# Altium project Acquisition-System.PrjPcb
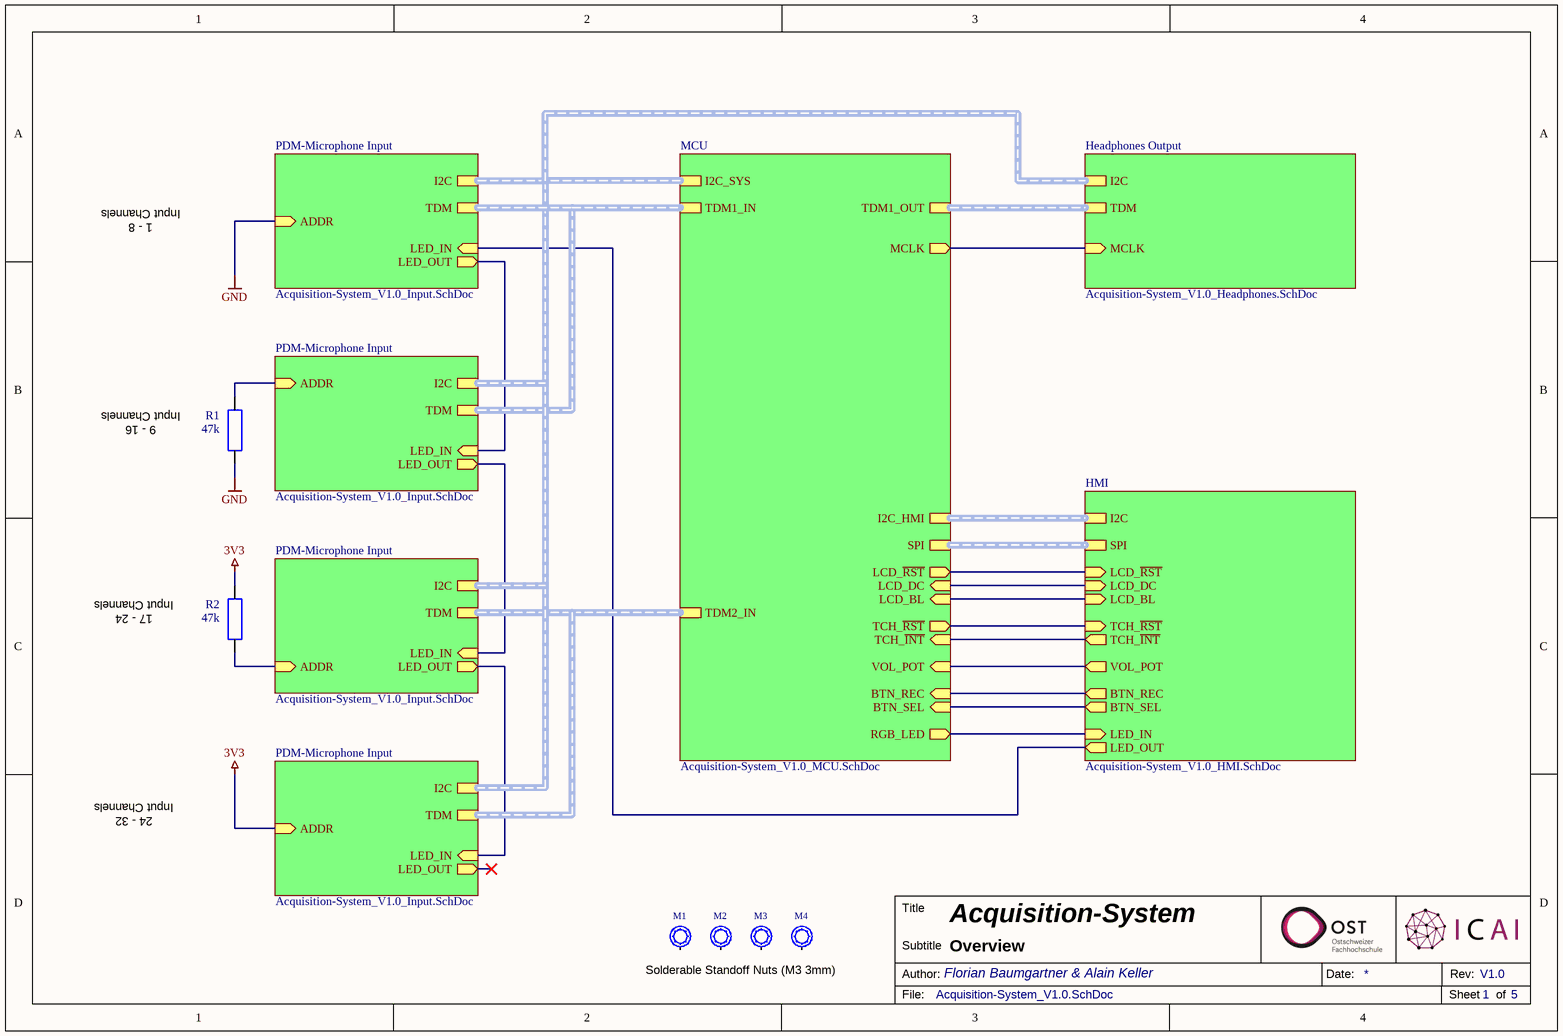
[diagram p0: Acquisition-System_V1.0.SchDoc]
5 sheets, 241 parts. Net scope: hierarchical (ports join the sheet entries above them; power ports are global).
Board file: Acquisition-System_V1.0.PcbDoc
Sheets:
  Acquisition-System_V1.0.SchDoc
    PDM-Microphone Input = Acquisition-System_V1.0_Input.SchDoc
    PDM-Microphone Input = Acquisition-System_V1.0_Input.SchDoc
    PDM-Microphone Input = Acquisition-System_V1.0_Input.SchDoc
    PDM-Microphone Input = Acquisition-System_V1.0_Input.SchDoc
    Headphones Output = Acquisition-System_V1.0_Headphones.SchDoc
    HMI = Acquisition-System_V1.0_HMI.SchDoc
    MCU = Acquisition-System_V1.0_MCU.SchDoc

## Sheet Acquisition-System_V1.0.SchDoc: Acquisition-System
size A4; PageSetup: Record=PageOptions|CenterHorizontal=True|CenterVertical=True|PrintScale=0.97|XCorrection=1.00|YCorrection=1.00|PrintKind=0|BorderSize=5000000|LeftOffset=0|BottomOffset=0|Orientation=2|PaperLength=1000|PaperWidth=1000|Scale=100|PaperSource=7|PrintQuality=-3|MediaType=1|DitherType=10|PrintScaleMode=1|PaperKind=A4|PaperIndex=9; Organization: Ostschweizer Fachhochschule; Address2: Florian Baumgartner & Alain Keller; Address3: florian.baumgartner@ost.ch; DocumentNumber: 1; Revision: V1.0; SheetNumber: 1; SheetTotal: 5; Author: Florian Baumgartner & Alain Keller; Subtitle: Overview

### Parts
M1  SMTSO-M3-3ET  [SMD Solder-Nut (M3 3mm)]  (value not drawn)
M2  SMTSO-M3-3ET  [SMD Solder-Nut (M3 3mm)]  (value not drawn)
M3  SMTSO-M3-3ET  [SMD Solder-Nut (M3 3mm)]  (value not drawn)
M4  SMTSO-M3-3ET  [SMD Solder-Nut (M3 3mm)]  (value not drawn)
R1  47k  [SMD Keramikkondensator 0603]
R2  47k  [SMD Keramikkondensator 0603]

### Sub-sheets
Headphones Output = Acquisition-System_V1.0_Headphones.SchDoc: I2C (harness I2C), TDM (harness TDM), MCLK (in)
HMI = Acquisition-System_V1.0_HMI.SchDoc: TCH_~{INT} (out), BTN_REC (out), TCH_~{RST} (in), LCD_BL (in), LCD_~{RST} (in), LED_IN (in), BTN_SEL (out), I2C (harness I2C), LCD_DC (in), SPI (harness SPI), VOL_POT (out), LED_OUT (out)
MCU = Acquisition-System_V1.0_MCU.SchDoc: I2C_SYS (harness I2C_SYS), LCD_BL (in), VOL_POT (in), MCLK (out), LCD_DC (in), TCH_~{RST} (out), RGB_LED (out), I2C_HMI (harness I2C_HMI), LCD_~{RST} (out), TDM1_OUT (harness TDM1_OUT), SPI (harness SPI), BTN_REC (in), BTN_SEL (in), TCH_~{INT} (in), TDM1_IN (harness TDM1_IN), TDM2_IN (harness TDM2_IN)
PDM-Microphone Input = Acquisition-System_V1.0_Input.SchDoc: I2C (harness I2C), LED_IN (in), TDM (harness TDM), LED_OUT (out), ADDR (in)
PDM-Microphone Input = Acquisition-System_V1.0_Input.SchDoc: I2C (harness I2C), LED_IN (in), TDM (harness TDM), LED_OUT (out), ADDR (in)
PDM-Microphone Input = Acquisition-System_V1.0_Input.SchDoc: I2C (harness I2C), LED_IN (in), TDM (harness TDM), LED_OUT (out), ADDR (in)
PDM-Microphone Input = Acquisition-System_V1.0_Input.SchDoc: I2C (harness I2C), LED_IN (in), TDM (harness TDM), LED_OUT (out), ADDR (in)

### Nets
3V3: R2.2 ; sheet PDM-Microphone Input/ADDR
GND: R1.1 ; sheet PDM-Microphone Input/ADDR
BTN_REC: sheet HMI/BTN_REC, sheet MCU/BTN_REC
BTN_SEL: sheet HMI/BTN_SEL, sheet MCU/BTN_SEL
LCD_BL: sheet HMI/LCD_BL, sheet MCU/LCD_BL
LCD_DC: sheet HMI/LCD_DC, sheet MCU/LCD_DC
LCD_~{RST}: sheet HMI/LCD_~{RST}, sheet MCU/LCD_~{RST}
RGB_LED: sheet HMI/LED_IN, sheet MCU/RGB_LED
TCH_~{INT}: sheet HMI/TCH_~{INT}, sheet MCU/TCH_~{INT}
TCH_~{RST}: sheet HMI/TCH_~{RST}, sheet MCU/TCH_~{RST}
TDM1_MCLK: sheet Headphones Output/MCLK, sheet MCU/MCLK
VOL_POT: sheet HMI/VOL_POT, sheet MCU/VOL_POT
NetP1A_4: sheet PDM-Microphone Input/LED_IN, sheet PDM-Microphone Input/LED_OUT
NetP1B_4: sheet PDM-Microphone Input/LED_IN, sheet PDM-Microphone Input/LED_OUT
NetP1C_4: sheet PDM-Microphone Input/LED_IN, sheet PDM-Microphone Input/LED_OUT
NetP1D_4: sheet PDM-Microphone Input/LED_IN, sheet HMI/LED_OUT
NetR1_2: R1.2 ; sheet PDM-Microphone Input/ADDR
NetR2_1: R2.1 ; sheet PDM-Microphone Input/ADDR

Not connected (* = marked no-connect by the designer): M1 1; M2 1; M3 1; M4 1

### Buses and harness runs
harness sheet Headphones Output/I2C = sheet MCU/I2C_SYS = sheet PDM-Microphone Input/I2C
harness sheet Headphones Output/TDM = sheet MCU/TDM1_OUT
harness sheet HMI/I2C = sheet MCU/I2C_HMI
harness sheet HMI/SPI = sheet MCU/SPI
harness sheet MCU/TDM1_IN = sheet PDM-Microphone Input/TDM
harness sheet MCU/TDM2_IN = sheet PDM-Microphone Input/TDM

### Notes on the sheet
- Input Channels
- 1 - 8
- (near R1) Input Channels
- 9 - 16
- 17 - 24
- 24 - 32
- Solderable Standoff Nuts (M3 3mm)
- Title
- Author:
- Subtitle
- Date:
- Rev:
- File:
- Sheet
- of

### Library data of the parts
M1-M4 = M-Spacer_M3_3mm: Solderable Standoff Nut; Component Value: M3 3mm; Mouser: 153-SMTSO-M3-3ET; Component Description: Solderable Standoff Nut; Unit Price: 0.05; JLC-Parts: C2915308; ComponentLink1Description: Datasheet; ComponentLink1URL: https://datasheet.lcsc.com/lcsc/2112061830_Sinhoo-SMTSO3030CTJ_C2915308.pdf
R1 R2 = R-RESISTOR: RES (E=Heizwiderstand B=Messwandler); Component Description: Thick Film Chip Resistor; Component Value: 47k (75V, 100mW, 1%); Digikey: P47.0KHCT-ND; Farnell: 2303213; Mouser: 667-ERJ-3EKF4702V; JLC-Parts: C25819; Unit Price: 0.01

## Sheet Acquisition-System_V1.0_Input.SchDoc: Acquisition-System
size A4; PageSetup: Record=PageOptions|CenterHorizontal=True|CenterVertical=True|PrintScale=0.97|XCorrection=1.00|YCorrection=1.00|PrintKind=0|BorderSize=5000000|LeftOffset=0|BottomOffset=0|Orientation=2|PaperLength=1000|PaperWidth=1000|Scale=100|PaperSource=7|PrintQuality=-3|MediaType=1|DitherType=10|PrintScaleMode=1|PaperKind=A4|PaperIndex=9; Organization: Ostschweizer Fachhochschule; Address2: Florian Baumgartner & Thierry Schwaller; Address3: florian.baumgartner@ost.ch; DocumentNumber: 2; Revision: V1.0; SheetNumber: 2; SheetTotal: 5; Author: Florian Baumgartner & Alain Keller; Subtitle: PDM-Microphone Input
Used 4 times, as channels PDM-Microphone Input, PDM-Microphone Input, PDM-Microphone Input, PDM-Microphone Input. Parts and nets are listed once, with the designators drawn on the sheet.
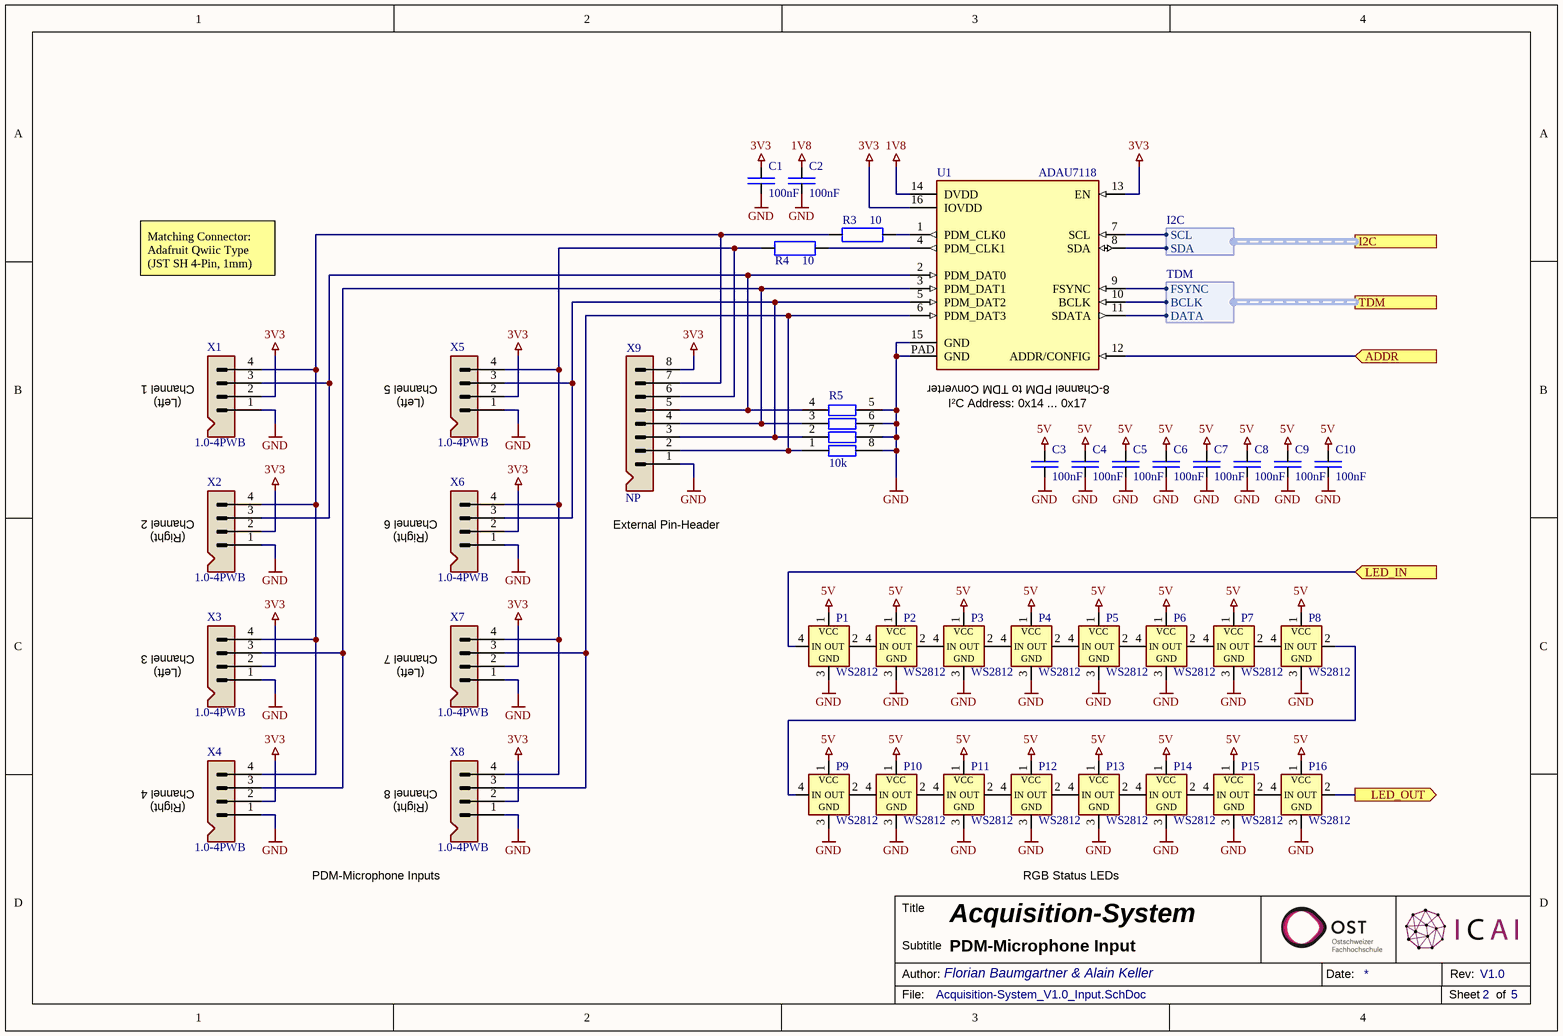
[diagram p1: Acquisition-System_V1.0_Input.SchDoc]

### Parts
C1  100nF  [SMD Keramikkondensator 0603]
C2  100nF  [SMD Keramikkondensator 0603]
C3  100nF  [SMD Keramikkondensator 0603]
C4  100nF  [SMD Keramikkondensator 0603]
C5  100nF  [SMD Keramikkondensator 0603]
C6  100nF  [SMD Keramikkondensator 0603]
C7  100nF  [SMD Keramikkondensator 0603]
C8  100nF  [SMD Keramikkondensator 0603]
C9  100nF  [SMD Keramikkondensator 0603]
C10  100nF  [SMD Keramikkondensator 0603]
P1  WS2812  [SMD LED WS2812B-0807]
P2  WS2812  [SMD LED WS2812B-0807]
P3  WS2812  [SMD LED WS2812B-0807]
P4  WS2812  [SMD LED WS2812B-0807]
P5  WS2812  [SMD LED WS2812B-0807]
P6  WS2812  [SMD LED WS2812B-0807]
P7  WS2812  [SMD LED WS2812B-0807]
P8  WS2812  [SMD LED WS2812B-0807]
P9  WS2812  [SMD LED WS2812B-0807]
P10  WS2812  [SMD LED WS2812B-0807]
P11  WS2812  [SMD LED WS2812B-0807]
P12  WS2812  [SMD LED WS2812B-0807]
P13  WS2812  [SMD LED WS2812B-0807]
P14  WS2812  [SMD LED WS2812B-0807]
P15  WS2812  [SMD LED WS2812B-0807]
P16  WS2812  [SMD LED WS2812B-0807]
R3  10  [SMD Widerstand 0603]
R4  10  [SMD Widerstand 0603]
R5  10k  [SMD Widerstand Array 4-Fach 0603]
U1  ADAU7118  [SMD IC QFN-16]
X1  1.0-4PWB  [SMD Connector (SM04B-SRSS-TB)]
X2  1.0-4PWB  [SMD Connector (SM04B-SRSS-TB)]
X3  1.0-4PWB  [SMD Connector (SM04B-SRSS-TB)]
X4  1.0-4PWB  [SMD Connector (SM04B-SRSS-TB)]
X5  1.0-4PWB  [SMD Connector (SM04B-SRSS-TB)]
X6  1.0-4PWB  [SMD Connector (SM04B-SRSS-TB)]
X7  1.0-4PWB  [SMD Connector (SM04B-SRSS-TB)]
X8  1.0-4PWB  [SMD Connector (SM04B-SRSS-TB)]
X9  NP  [THT Pin-Header 1x8 (NP)]

### Ports
ADDR (in), I2C (harness I2C), LED_IN (in), LED_OUT (out), TDM (harness TDM)

### Harnesses
TDM: BCLK, FSYNC, DATA
I2C: SCL, SDA

### Nets
1V8: C2.2 U1.14(DVDD)
3V3: C1.2 U1.13(EN) U1.16(IOVDD) X1.2 X2.2 X3.2 X4.2 X5.2 X6.2 X7.2 X8.2 X9.8
5V: C3.2 C4.2 C5.2 C6.2 C7.2 C8.2 C9.2 C10.2 P1.1(VCC) P2.1(VCC) P3.1(VCC) P4.1(VCC) P5.1(VCC) P6.1(VCC) P7.1(VCC) P8.1(VCC) P9.1(VCC) P10.1(VCC) P11.1(VCC) P12.1(VCC) P13.1(VCC) P14.1(VCC) P15.1(VCC) P16.1(VCC)
GND: C1.1 C2.1 C3.1 C4.1 C5.1 C6.1 C7.1 C8.1 C9.1 C10.1 P1.3(GND) P2.3(GND) P3.3(GND) P4.3(GND) P5.3(GND) P6.3(GND) P7.3(GND) P8.3(GND) P9.3(GND) P10.3(GND) P11.3(GND) P12.3(GND) P13.3(GND) P14.3(GND) P15.3(GND) P16.3(GND) R5.5 R5.6 R5.7 R5.8 U1.15(GND) U1.PAD(GND) X1.1 X2.1 X3.1 X4.1 X5.1 X6.1 X7.1 X8.1 X9.1
ADDR: U1.12(ADDR/CONFIG) ; port ADDR
LED_IN: P1.4(IN) ; port LED_IN
LED_OUT: P16.2(OUT) ; port LED_OUT
NetP1_2: P1.2(OUT) P2.4(IN)
NetP2_2: P2.2(OUT) P3.4(IN)
NetP3_2: P3.2(OUT) P4.4(IN)
NetP4_2: P4.2(OUT) P5.4(IN)
NetP5_2: P5.2(OUT) P6.4(IN)
NetP6_2: P6.2(OUT) P7.4(IN)
NetP7_2: P7.2(OUT) P8.4(IN)
NetP8_2: P8.2(OUT) P9.4(IN)
NetP9_2: P9.2(OUT) P10.4(IN)
NetP10_2: P10.2(OUT) P11.4(IN)
NetP11_2: P11.2(OUT) P12.4(IN)
NetP12_2: P12.2(OUT) P13.4(IN)
NetP13_2: P13.2(OUT) P14.4(IN)
NetP14_2: P14.2(OUT) P15.4(IN)
NetP15_2: P15.2(OUT) P16.4(IN)
NetR3_1: R3.1 U1.1(PDM_CLK0)
NetR3_2: R3.2 X1.4 X2.4 X3.4 X4.4 X9.7
NetR4_1: R4.1 U1.4(PDM_CLK1)
NetR4_2: R4.2 X5.4 X6.4 X7.4 X8.4 X9.6
NetR5_1: R5.1 U1.6(PDM_DAT3) X7.3 X8.3 X9.2
NetR5_2: R5.2 U1.5(PDM_DAT2) X5.3 X6.3 X9.3
NetR5_3: R5.3 U1.3(PDM_DAT1) X3.3 X4.3 X9.4
NetR5_4: R5.4 U1.2(PDM_DAT0) X1.3 X2.3 X9.5
NetU1_7: U1.7(SCL) ; port I2C.SCL
NetU1_8: U1.8(SDA) ; port I2C.SDA
NetU1_9: U1.9(NC) ; port TDM.FSYNC
NetU1_10: U1.10(NC) ; port TDM.BCLK
NetU1_11: U1.11(NC) ; port TDM.DATA

### Channels
PDM-Microphone Input: designators end in A; ports ADDR=3V3 LED_IN=NetP1A_4 LED_OUT=NetP16A_2
PDM-Microphone Input: designators end in B; ports ADDR=NetR2_1 LED_IN=NetP1B_4 LED_OUT=NetP1A_4
PDM-Microphone Input: designators end in C; ports ADDR=NetR1_2 LED_IN=NetP1C_4 LED_OUT=NetP1B_4
PDM-Microphone Input: designators end in D; ports ADDR=GND LED_IN=NetP1D_4 LED_OUT=NetP1C_4

### Notes on the sheet
- Matching Connector:
  Adafruit Qwiic Type
  (JST SH 4-Pin, 1mm)
- (near X1) Channel 1
- (near X5) Channel 5
- (near U1) 8-Channel PDM to TDM Converter
- (near X1) (Left)
- (near X5) (Left)
- I²C Address: 0x14 ... 0x17
- (near X2) Channel 2
- (near X6) Channel 6
- External Pin-Header
- (near X2) (Right)
- (near X6) (Right)
- (near X3) Channel 3
- (near X7) Channel 7
- (near X3) (Left)
- (near X7) (Left)
- (near X4) Channel 4
- (near X8) Channel 8
- (near X4) (Right)
- (near X8) (Right)
- PDM-Microphone Inputs
- RGB Status LEDs
- Title
- Author:
- Subtitle
- Date:
- Rev:
- File:
- Sheet
- of

### Library data of the parts
C1-C10 = E6 - 100nF: SMD Ceramic Capacitor E6; Component Value: 100nF 50V; Component Description: Multilayer Ceramic Capacitors MLCC; ComponentLink1Description: Datasheet; ComponentLink1URL: https://datasheet.lcsc.com/lcsc/1809301912_YAGEO-CC0603KRX7R9BB104_C14663.pdf; Digikey: 445-6899-1-ND; Farnell: 2210822; JLC-Parts: C14663; Mouser: 810-CGA2B3X7R1H104K; Unit Price: 0.01
P1-P16 = P-WS2812B-0807: Smart RGB-LED; aliExpress: 1005003999865721; Component Value: XL-0807RGBC-WS2812B; JLC-Parts: C3646929; ComponentLink1Description: Datasheet; ComponentLink1URL: https://datasheet.lcsc.com/lcsc/2108251530_OPSCO-Optoelectronics-SK6812D-EC3210R_C2890041.pdf; Component Description: Smart RGB-LED; Unit Price: 0.07
R3 R4 = R-RESISTOR: RES (E=Heizwiderstand B=Messwandler); Component Description: Thick Film Chip Resistor; Component Value: 10 (75V, 100mW, 1%); Digikey: P10.0HCT-ND; Farnell: 2302958; Mouser: 667-ERJ-3EKF10R0V; JLC-Parts: C22859; Unit Price: 0.01
R5 = R-Array Single Quad E24 - 10k: Isolated Resistor Array; Component Value: 10k (4x, 50V, 62.5mW, 5%); ComponentLink1Description: Datasheet; ComponentLink1URL: https://datasheet.lcsc.com/lcsc/1810191515_UNI-ROYAL-Uniroyal-Elec-4D03WGJ0103T5E_C29718.pdf; Digikey: Y4103CT-ND; Farnell: 2060167; JLC-Parts: C29718; Mouser: 667-EXB-V8V103JV; Unit Price: 0.01; Component Description: Isolated Resistor Array
U1 = U-ADAU7118: 8-Channel PDM to I²S/TDM Converter; Component Value: ADAU7118ACPZRL; ComponentLink1Description: Datasheet; ComponentLink1URL: https://www.analog.com/media/en/technical-documentation/data-sheets/ADAU7118.pdf; Digikey: 505-ADAU7118ACPZRLCT-ND; Farnell: 4033291; JLC-Parts: C654437; Mouser: 584-ADAU7118ACPZRL; Unit Price: 6.20; Component Description: 8-Channel PDM to I²S/TDM Converter
X1-X8 = X-Stiftleiste (4-Fach): Wire To Board Connector (1x4P 1.0mm); Digikey: 455-SM04B-SRSS-TBCT-ND; Farnell: 1830839; Component Description: Wire To Board Connector (1x4P 1.0mm); Component Value: 1.0-4PWB; JLC-Parts: C2905006; Unit Price: 0.03
X9 = X-Stiftleiste (8-Fach): Component Description: Pin Header; Component Value: 8-Pin (2.54mm)

## Sheet Acquisition-System_V1.0_Headphones.SchDoc: Acquisition-System
size A4; PageSetup: Record=PageOptions|CenterHorizontal=True|CenterVertical=True|PrintScale=0.97|XCorrection=1.00|YCorrection=1.00|PrintKind=0|BorderSize=5000000|LeftOffset=0|BottomOffset=0|Orientation=2|PaperLength=1000|PaperWidth=1000|Scale=100|PaperSource=7|PrintQuality=-3|MediaType=1|DitherType=10|PrintScaleMode=1|PaperKind=A4|PaperIndex=9; Organization: Ostschweizer Fachhochschule; Address2: Florian Baumgartner & Thierry Schwaller; Address3: florian.baumgartner@ost.ch; DocumentNumber: 3; Revision: V1.0; SheetNumber: 3; SheetTotal: 5; Author: Florian Baumgartner & Alain Keller; Subtitle: Headphones Output
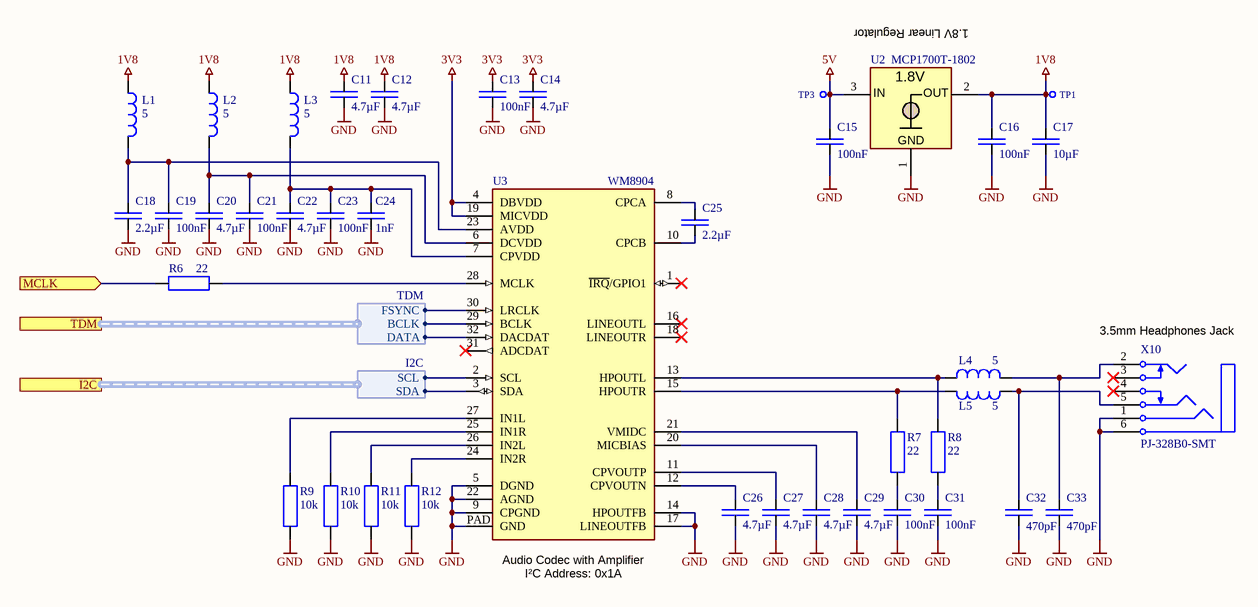
[diagram p2: Acquisition-System_V1.0_Headphones.SchDoc]

### Parts
C11  4.7µF  [SMD Keramikkondensator 0603]
C12  4.7µF  [SMD Keramikkondensator 0603]
C13  100nF  [SMD Keramikkondensator 0603]
C14  4.7µF  [SMD Keramikkondensator 0603]
C15  100nF  [SMD Keramikkondensator 0603]
C16  100nF  [SMD Keramikkondensator 0603]
C17  10µF  [SMD Keramikkondensator 1206]
C18  2.2µF  [SMD Keramikkondensator 0603]
C19  100nF  [SMD Keramikkondensator 0603]
C20  4.7µF  [SMD Keramikkondensator 0603]
C21  100nF  [SMD Keramikkondensator 0603]
C22  4.7µF  [SMD Keramikkondensator 0603]
C23  100nF  [SMD Keramikkondensator 0603]
C24  1nF  [SMD Keramikkondensator 0603]
C25  2.2µF  [SMD Keramikkondensator 0603]
C26  4.7µF  [SMD Keramikkondensator 0603]
C27  4.7µF  [SMD Keramikkondensator 0603]
C28  4.7µF  [SMD Keramikkondensator 0603]
C29  4.7µF  [SMD Keramikkondensator 0603]
C30  100nF  [SMD Keramikkondensator 0603]
C31  100nF  [SMD Keramikkondensator 0603]
C32  470pF  [SMD Keramikkondensator 0603]
C33  470pF  [SMD Keramikkondensator 0603]
L1  5  [SMD Ferrite Bead 0603]
L2  5  [SMD Ferrite Bead 0603]
L3  5  [SMD Ferrite Bead 0603]
L4  5  [SMD Ferrite Bead 0603]
L5  5  [SMD Ferrite Bead 0603]
R6  22  [SMD Widerstand 0603]
R7  22  [SMD Widerstand 0603]
R8  22  [SMD Widerstand 0603]
R9  10k  [SMD Widerstand 0603]
R10  10k  [SMD Widerstand 0603]
R11  10k  [SMD Widerstand 0603]
R12  10k  [SMD Widerstand 0603]
TP1  X-TP  [THT Testpunkt Ø1mm]  (value not drawn)  (no BOM)
TP3  X-TP  [THT Testpunkt Ø1mm]  (value not drawn)  (no BOM)
U2  MCP1700T-1802  [SMD IC SOT-23-3]
U3  WM8904  [SMD IC QFN-32 (0.4mm)]
X10  PJ-328B0-SMT  [SMD 3.5mm Jack (PJ-328B0-SMT)]

### Ports
I2C (harness I2C), MCLK (in), TDM (harness TDM)

### Harnesses
I2C: SCL, SDA
TDM: BCLK, FSYNC, DATA

### Nets
1V8: C11.2 C12.2 C16.2 C17.2 L1.1 L2.1 L3.1 TP1.1 U2.2(OUT)
3V3: C13.2 C14.2 U3.4(DBVDD) U3.19(MICVDD)
5V: C15.2 TP3.1 U2.3(IN)
GND: C11.1 C12.1 C13.1 C14.1 C15.1 C16.1 C17.1 C18.1 C19.1 C20.1 C21.1 C22.1 C23.1 C24.1 C26.1 C27.1 C28.1 C29.1 C30.1 C31.1 C32.2 C33.2 R9.1 R10.1 R11.1 R12.1 U2.1(GND) U3.5(DGND) U3.9(NC) U3.14(HPOUTFB) U3.17(LINEOUTFB) U3.22(AGND) U3.PAD(GND) X10.1 X10.6
SCL_SYS: U3.2(SCL) ; port I2C.SCL
SDA_SYS: U3.3(SDA) ; port I2C.SDA
TDM1_BCLK: U3.29(BCLK) ; port TDM.BCLK
TDM1_FSYNC: U3.30(LRCLK) ; port TDM.FSYNC
TDM1_MCLK: R6.1 ; port MCLK
TDM1_TX: U3.32(DACDAT) ; port TDM.DATA
NetC18_2: C18.2 C19.2 L1.2 U3.23(AVDD)
NetC20_2: C20.2 C21.2 L2.2 U3.6(DCVDD)
NetC22_2: C22.2 C23.2 C24.2 L3.2 U3.7(CPVDD)
NetC25_1: C25.1 U3.10(NC)
NetC25_2: C25.2 U3.8(CPCA)
NetC26_2: C26.2 U3.12(CPVOUTN)
NetC27_2: C27.2 U3.11(NC)
NetC28_2: C28.2 U3.20(MICBIAS)
NetC29_2: C29.2 U3.21(VMIDC)
NetC30_2: C30.2 R7.2
NetC31_2: C31.2 R8.2
NetC32_1: C32.1 L5.1 X10.5
NetC33_1: C33.1 L4.1 X10.2
NetL4_2: L4.2 R8.1 U3.13(HPOUTL)
NetL5_2: L5.2 R7.1 U3.15(HPOUTR)
NetR6_2: R6.2 U3.28(MCLK)
NetR9_2: R9.2 U3.27(IN1L)
NetR10_2: R10.2 U3.25(IN1R)
NetR11_2: R11.2 U3.26(IN2L)
NetR12_2: R12.2 U3.24(IN2R)

Not connected (* = marked no-connect by the designer): U3 1(~{IRQ}/GPIO1)* 16(LINEOUTL)* 18(LINEOUTR)* 31(ADCDAT)*; X10 3* 4* 9(NC) 10(NC) 11(NC)

### Notes on the sheet
- 1.8V Linear Regulator
- (near X10) 3.5mm Headphones Jack
- (near U3) Audio Codec with Amplifier
- (near U3) I²C Address: 0x1A
- Title
- Author:
- Subtitle
- Date:
- Rev:
- File:
- Sheet
- of
- (in symbol T-MCP1700T-1.8) 1.8V

### Library data of the parts
C11 C12 C14 C20 C22 C26-C29 = C-CAPACITOR: CAP-MK; Component Description: Multilayer Ceramic Capacitors; Component Value: 4.7µF 16V; Digikey: 1276-1784-1-ND; Farnell: 3013397; Mouser: 187-CL10A475KO8NNNC; JLC-Parts: C19666; Unit Price: 0.01
C13 C15 C16 C19 C21 C23 C30 C31 = E6 - 100nF: as C1 on sheet Acquisition-System_V1.0_Input; ComponentLink1Description: Datasheet; ComponentLink1URL: https://datasheet.lcsc.com/lcsc/1809301912_YAGEO-CC0603KRX7R9BB104_C14663.pdf; Digikey: 445-6899-1-ND; Farnell: 2210822; JLC-Parts: C14663; Mouser: 810-CGA2B3X7R1H104K; Unit Price: 0.01
C17 = E6 - 10uF: SMD Ceramic Capacitor E6; Component Value: 10µF 50V; Component Description: Multilayer Ceramic Capacitors MLCC; ComponentLink1Description: Datasheet; ComponentLink1URL: https://datasheet.lcsc.com/lcsc/1810191219_Samsung-Electro-Mechanics-CL10A106KP8NNNC_C19702.pdf; Digikey: 587-3258-1-ND; Farnell: 2113070; JLC-Parts: C13585; Mouser: 963-LMK107BBJ106MALT; Unit Price: 0.01
C18 C25 = C-CAPACITOR: CAP-MK; Component Description: Multilayer Ceramic Capacitors; Component Value: 2.2µF 16V; Digikey: 1276-1040-1-ND; Farnell: 3013392; Mouser: 187-CL10A225KO8NNNC; JLC-Parts: C23630; Unit Price: 0.01
C24 = C-CAPACITOR: CAP-MK; Component Description: Multilayer Ceramic Capacitors; Component Value: 1nF 50V; Digikey: 445-5659-1-ND; Farnell: 2435473; Mouser: 810-CGA3E2X7R1H102K; JLC-Parts: C1588; Unit Price: 0.01
C32 C33 = C-CAPACITOR: CAP-MK; Component Description: Multilayer Ceramic Capacitors; Component Value: 470pF 50V; Digikey: 399-C0603C471J5GAC7867CT-ND; Farnell: 1414640; Mouser: 80-C0603C471J5G; JLC-Parts: C107092; Unit Price: 0.01
L1-L5 = R-COIL (HF): COIL (Spule alt L); Component Description: Ferrite Bead; Component Value: GZ2012D601TF (5 Ohm@100MHz, 700mA); Farnell: 3650622; Mouser: 810-MMZ1608D050CTA00; Digikey: 445-MMZ1608D050CTA00CT-ND; ComponentLink1Description: Datasheet; ComponentLink1URL: https://datasheet.lcsc.com/lcsc/2304140030_TDK-MMZ1608D050CTA00_C307759.pdf; JLC-Parts: C307759; Unit Price: 0.01
R6-R8 = R-RESISTOR: RES (E=Heizwiderstand B=Messwandler); Component Description: Thick Film Chip Resistor; Component Value: 22 (75V, 100mW, 1%); Digikey: P22.0HCT-ND; Farnell: 2302996; Mouser: 667-ERJ-3EKF22R0V; JLC-Parts: C23345; Unit Price: 0.01
R9-R12 = R-RESISTOR: RES (E=Heizwiderstand B=Messwandler); Component Description: Thick Film Chip Resistor; Component Value: 10k (75V, 100mW, 1%); Digikey: P10.0KHCT-ND; Farnell: 2303192; Mouser: 667-ERJ-3EKF1002V; JLC-Parts: C25804; Unit Price: 0.01
TP1 TP3 = X-TP: Testpunkt; Component Value: Ø 0.8mm; Component Description: Testpunkt; Unit Price: 0.00
U2 = T-MCP1700T-1.8: Voltage Regulator; Component Description: Linear Voltage Regulator; Component Value: MCP1700T-1802E (1.8V, 200mA); Digikey: MCP1700T1802ETTCT-ND; Farnell: 1296591; Mouser: 579-MCP1700T1802E/TT; ComponentLink2Description: Datasheet; ComponentLink2URL: https://datasheet.lcsc.com/lcsc/2304140030_Microchip-Tech-MCP1700T-1802E-TT_C150796.pdf; JLC-Parts: C150796; Unit Price: 0.37
U3 = U-WM8904: Low-Power Audio Codec with Headphones Driver; Component Value: WM8904CGEFL; ComponentLink1Description: Datasheet; ComponentLink1URL: https://statics.cirrus.com/pubs/proDatasheet/WM8904_Rev4.0.pdf; Digikey: 598-2437-1-ND; JLC-Parts: C323845; Mouser: 238-WM8904CGEFL/RV; Unit Price: 1.37; Component Description: Low-Power Audio Codec with Headphones Driver
X10 = X-PJ-328B0-SMT: 3.5mm Headphone Jack 4-Pin; ComponentLink1Description: Datasheet; ComponentLink1URL: https://datasheet.lcsc.com/lcsc/2002271917_XKB-Connectivity-PJ-328B0-SMT_C437035.pdf; Digikey: CP-43514SJCT-ND; Component Value: PJ-328B0-SMT; JLC-Parts: C437035; Mouser: 490-SJ-43514-SMT-TR; Unit Price: 0.23; Component Description: 3.5mm Headphone Jack 4-Pin

## Sheet Acquisition-System_V1.0_HMI.SchDoc: Acquisition-System
size A4; PageSetup: Record=PageOptions|CenterHorizontal=True|CenterVertical=True|PrintScale=0.97|XCorrection=1.00|YCorrection=1.00|PrintKind=0|BorderSize=5000000|LeftOffset=0|BottomOffset=0|Orientation=2|PaperLength=1000|PaperWidth=1000|Scale=100|PaperSource=7|PrintQuality=-3|MediaType=1|DitherType=10|PrintScaleMode=1|PaperKind=A4|PaperIndex=9; Organization: Ostschweizer Fachhochschule; Address2: Florian Baumgartner & Thierry Schwaller; Address3: florian.baumgartner@ost.ch; DocumentNumber: 5; Revision: V1.0; SheetNumber: 5; SheetTotal: 5; Author: Florian Baumgartner & Alain Keller; Subtitle: HMI
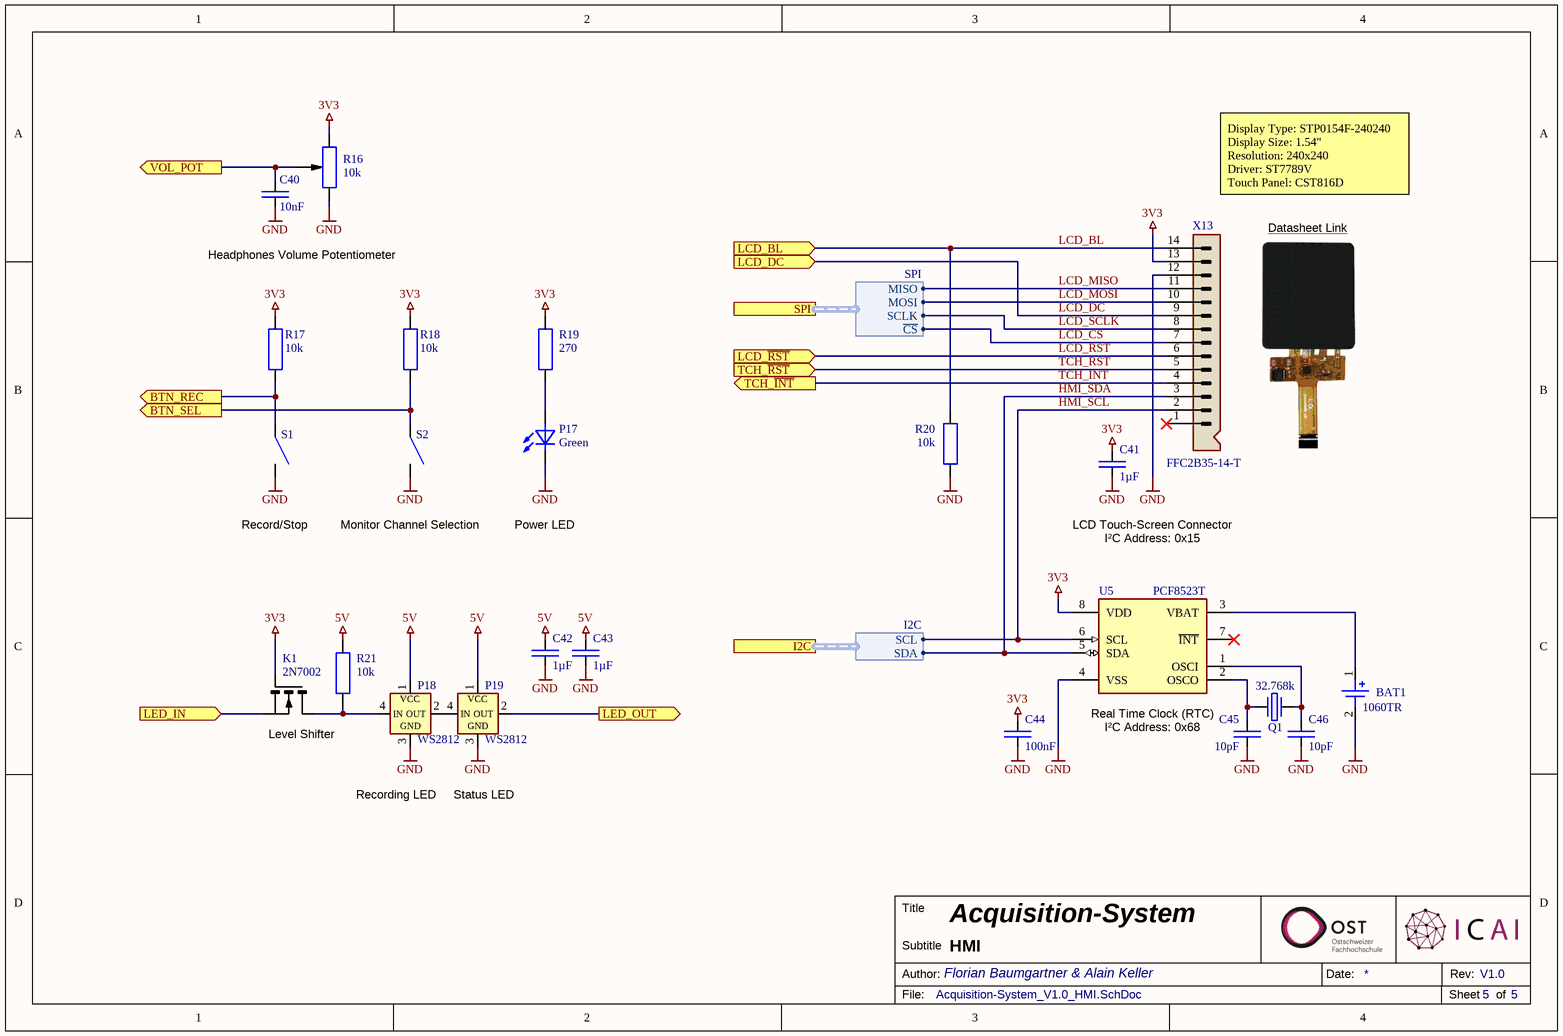
[diagram p3: Acquisition-System_V1.0_HMI.SchDoc]

### Parts
BAT1  1060TR  [SMD Battery-Holder (1060TR)]
C40  10nF  [SMD Keramikkondensator 0603]
C41  1µF  [SMD Keramikkondensator 0603]
C42  1µF  [SMD Keramikkondensator 0603]
C43  1µF  [SMD Keramikkondensator 0603]
C44  100nF  [SMD Keramikkondensator 0603]
C45  10pF  [SMD Keramikkondensator 0603]
C46  10pF  [SMD Keramikkondensator 0603]
K1  2N7002  [SMD MOSFET SOT-23]
P17  Green  [SMD LED 0603]
P18  WS2812  [SMD LED WS2812B-0807]
P19  WS2812  [SMD LED WS2812B-0807]
Q1  32.768k  [SMD Crystal 3.2x1.5x0.9]
R16  10k  [SMD Potentiometer (RK10J11R0A0H)]
R17  10k  [SMD Widerstand 0603]
R18  10k  [SMD Widerstand 0603]
R19  270  [SMD Widerstand 0603]
R20  10k  [SMD Widerstand 0603]
R21  10k  [SMD Widerstand 0603]
S1  SMD-Button  [SMD Button 6.5x6.0x2.5]  (value not drawn)
S2  SMD-Button  [SMD Button 6.5x6.0x2.5]  (value not drawn)
U5  PCF8523T  [SMD IC SOIC-8]
X13  FFC2B35-14-T  [SMD Display 1.54" (STP0154F-240240)]

### Ports
BTN_REC (out), BTN_SEL (out), I2C (harness I2C), LCD_BL (in), LCD_DC (in), LCD_~{RST} (in), LED_IN (in), LED_OUT (out), SPI (harness SPI), TCH_~{INT} (out), TCH_~{RST} (in), VOL_POT (out)

### Harnesses
I2C: SCL, SDA
SPI: SCLK, MOSI, ~{CS}, MISO

### Nets
3V3: C41.2 C44.2 K1.G R16.CCW R17.2 R18.2 R19.1 U5.8(VDD) X13.13
5V: C42.2 C43.2 P18.1(VCC) P19.1(VCC) R21.2
GND: BAT1.2(N) C40.1 C41.1 C42.1 C43.1 C44.1 C45.2 C46.2 P17.K P18.3(GND) P19.3(GND) R16.CW R20.1 S1.2 S2.2 U5.4(VSS) X13.12
BTN_REC: R17.1 S1.1 ; port BTN_REC
BTN_SEL: R18.1 S2.1 ; port BTN_SEL
HMI_SCL: U5.6(SCL) X13.2 ; port I2C.SCL
HMI_SDA: U5.5(SDA) X13.3 ; port I2C.SDA
LCD_BL: R20.2 X13.14 ; port LCD_BL
LCD_~{CS}: X13.7 ; port SPI.~{CS}
LCD_DC: X13.9 ; port LCD_DC
LCD_MISO: X13.11 ; port SPI.MISO
LCD_MOSI: X13.10 ; port SPI.MOSI
LCD_~{RST}: X13.6 ; port LCD_~{RST}
LCD_SCLK: X13.8 ; port SPI.SCLK
RGB_LED: K1.S ; port LED_IN
TCH_~{INT}: X13.4 ; port TCH_~{INT}
TCH_~{RST}: X13.5 ; port TCH_~{RST}
VOL_POT: C40.2 R16.M ; port VOL_POT
NetBAT1_1: BAT1.1(P) U5.3(VBAT)
NetC45_1: C45.1 Q1.1 U5.2(OSCO)
NetC46_1: C46.1 Q1.2 U5.1(OSCI)
NetK1_D: K1.D P18.4(IN) R21.1
NetP1D_4: P19.2(OUT) ; port LED_OUT
NetP17_A: P17.A R19.2
NetP18_2: P18.2(OUT) P19.4(IN)

Not connected (* = marked no-connect by the designer): U5 7(~{INT})* 9(NC) 10(NC) 11(NC); X13 1*

### Notes on the sheet
- Headphones Volume Potentiometer
- Display Type: STP0154F-240240
  Display Size: 1.54"
  Resolution: 240x240
  Driver: ST7789V
  Touch Panel: CST816D
- Datasheet Link <http://surenoo.tech/download/04_STP/0154/STP0154F-240240.pdf>
- Record/Stop
- Monitor Channel Selection
- Power LED
- LCD Touch-Screen Connector
- I²C Address: 0x15
- Real Time Clock (RTC)
- (near K1) Level Shifter
- Recording LED
- Status LED
- I²C Address: 0x68
- Title
- Author:
- Subtitle
- Date:
- Rev:
- File:
- Sheet
- of

### Library data of the parts
BAT1 = X-CR2032-Battery-Holder: Battery Holder (CR2032); Component Value: 1060TR; Digikey: 36-1060CT-ND; Farnell: 2533470; Mouser: 534-1060TR; Unit Price: 0.25; ComponentLink1Description: Datasheet; ComponentLink1URL: https://datasheet.lcsc.com/lcsc/2012181808_MYOUNG-BS-06-B4AA002_C964756.pdf; JLC-Parts: C964756; Component Description: Battery Holder (CR2032)
C40 = C-CAPACITOR: CAP-MK; Component Description: Multilayer Ceramic Capacitors; Component Value: 10nF 50V; Digikey: 445-5662-1-ND; Farnell: 2346966; Mouser: 77-VJ0603V103ZXAPBC; JLC-Parts: C57112; Unit Price: 0.01
C41-C43 = C-CAPACITOR: CAP-MK; Component Description: Multilayer Ceramic Capacitors; Component Value: 1µF 50V; Digikey: 1276-1860-1-ND; Farnell: 3013383; Mouser: 187-CL10A105KB8NNNC; JLC-Parts: C15849; Unit Price: 0.01
C44 = E6 - 100nF: as C1 on sheet Acquisition-System_V1.0_Input; ComponentLink1Description: Datasheet; ComponentLink1URL: https://datasheet.lcsc.com/lcsc/1809301912_YAGEO-CC0603KRX7R9BB104_C14663.pdf; Digikey: 445-6899-1-ND; Farnell: 2210822; JLC-Parts: C14663; Mouser: 810-CGA2B3X7R1H104K; Unit Price: 0.01
C45 C46 = C-CAPACITOR: CAP-MK; Component Description: Multilayer Ceramic Capacitors; Component Value: 10pF 50V; Digikey: 399-C0603C100J5GAC7867CT-ND; Farnell: 1414601; Mouser: 80-C0603C100J5G; JLC-Parts: C1634; Unit Price: 0.01
K1 = K-FET:NIGE: MOSFET N-Channel; Digikey: 2N7002NCT-ND; Farnell: 1713823; Mouser: 512-2N7002; ComponentLink1Description: Datasheet; ComponentLink1URL: https://datasheet.lcsc.com/lcsc/1810151612_Jiangsu-Changjing-Electronics-Technology-Co---Ltd--2N7002_C8545.pdf; Component Description: MOSFET N-Channel; Component Value: 2N7002; JLC-Parts: C8545; Unit Price: 0.02
P17 = LED Green 0603: General Purpose LED; Component Value: Green (5mA, 2.4V); Digikey: 350-2035-1-ND; Farnell: 1465991; Mouser: 645-598-8070-107F; Unit Price: 0.34; ComponentLink1Description: Datasheet; ComponentLink1URL: https://datasheet.lcsc.com/szlcsc/Everlight-Elec-19-217-GHC-YR1S2-3T_C72043.pdf; JLC-Parts: C72043; Component Description: General Purpose LED
P18 P19 = P-WS2812B-0807: as P1 on sheet Acquisition-System_V1.0_Input; JLC-Parts: C3646929; ComponentLink1Description: Datasheet; ComponentLink1URL: https://datasheet.lcsc.com/lcsc/2108251530_OPSCO-Optoelectronics-SK6812D-EC3210R_C2890041.pdf; Component Description: Smart RGB-LED; Unit Price: 0.07
Q1 = Q-Crystal: Component Value: 32.768kHz; Digikey: SER4103CT-ND; Mouser: 732-532.7680KA-A5; Component Description: Crystal; ComponentLink1Description: Datasheet; ComponentLink1URL: https://datasheet.lcsc.com/lcsc/1810171817_Seiko-Epson-Q13FC1350000400_C32346.pdf; JLC-Parts: C32346; Unit Price: 0.18
R16 = R-RES:VAR: RES-VAR; Component Description: Potentiometer; Component Value: RK10J11R0A0H (Dual 10k); ComponentLink1Description: Datasheet; ComponentLink1URL: https://docs.rs-online.com/6334/A700000006802142.pdf; JLC-Parts: C470766; Mouser: 688-RK10J11R0A0H; Unit Price: 0.60
R17 R18 R20 R21 = R-RESISTOR: as R9 on sheet Acquisition-System_V1.0_Headphones; Digikey: P10.0KHCT-ND; Farnell: 2303192; Mouser: 667-ERJ-3EKF1002V; JLC-Parts: C25804; Unit Price: 0.01
R19 = R-RESISTOR: SMD-Widerstand 1/4W; Component Description: Thick Film Chip Resistor; Component Value: 270 (75V, 100mW, 1%); Digikey: P270HCT-ND; Farnell: 2303096; Mouser: 667-ERJ-3EKF2700V; JLC-Parts: C22966; Unit Price: 0.06
S1 S2 = Button 3mmx2.5mm: Button SPST; Component Value: EVQQ2U02W; Component Description: Tactile Switch; Digikey: P12954SCT-ND; ComponentLink1Description: Datasheet; ComponentLink1URL: https://datasheet.lcsc.com/lcsc/1912111437_PANASONIC-EVQQ2U02W_C395227.pdf; Farnell: 2860932; JLC-Parts: C395227; Mouser: 667-EVQ-Q2U02W; Unit Price: 0.19
U5 = U-PCF8523T: Real-Time Clock (RTC) and Calendar; Component Value: PCF8523T/1,118; ComponentLink1Description: Datasheet; ComponentLink1URL: https://www.nxp.com/docs/en/data-sheet/PCF8523.pdf; Digikey: 568-5306-1-ND; Farnell: 2400452; JLC-Parts: C2651516; Mouser: 771-PCF8523T/1118; Unit Price: 1.35; Component Description: Real-Time Clock (RTC) and Calendar
X13 = X-FPC-Connector (14-Pin): FPC-Connector (14-Pin, Front Flip,  Bottom Contact); Digikey: 2073-FFC2B35-14-TDKR-ND; Farnell: 3933420; Mouser: 640-FFC2B35-14-T; Component Description: FPC-Connector (14-Pin, Front Flip,  Bottom Contact); Component Value: FFC2B35-14-T; JLC-Parts: C262663; Unit Price: 0.09; ComponentLink2Description: Datasheet; ComponentLink2URL: https://gct.co/files/drawings/ffc2b35.pdf

## Sheet Acquisition-System_V1.0_MCU.SchDoc: Acquisition-System
size A4; PageSetup: Record=PageOptions|CenterHorizontal=True|CenterVertical=True|PrintScale=0.97|XCorrection=1.00|YCorrection=1.00|PrintKind=0|BorderSize=5000000|LeftOffset=0|BottomOffset=0|Orientation=2|PaperLength=1000|PaperWidth=1000|Scale=100|PaperSource=7|PrintQuality=-3|MediaType=1|DitherType=10|PrintScaleMode=1|PaperKind=A4|PaperIndex=9; Organization: Ostschweizer Fachhochschule; Address2: Florian Baumgartner & Thierry Schwaller; Address3: florian.baumgartner@ost.ch; DocumentNumber: 4; Revision: V1.0; SheetNumber: 4; SheetTotal: 5; Author: Florian Baumgartner & Alain Keller; Subtitle: MCU
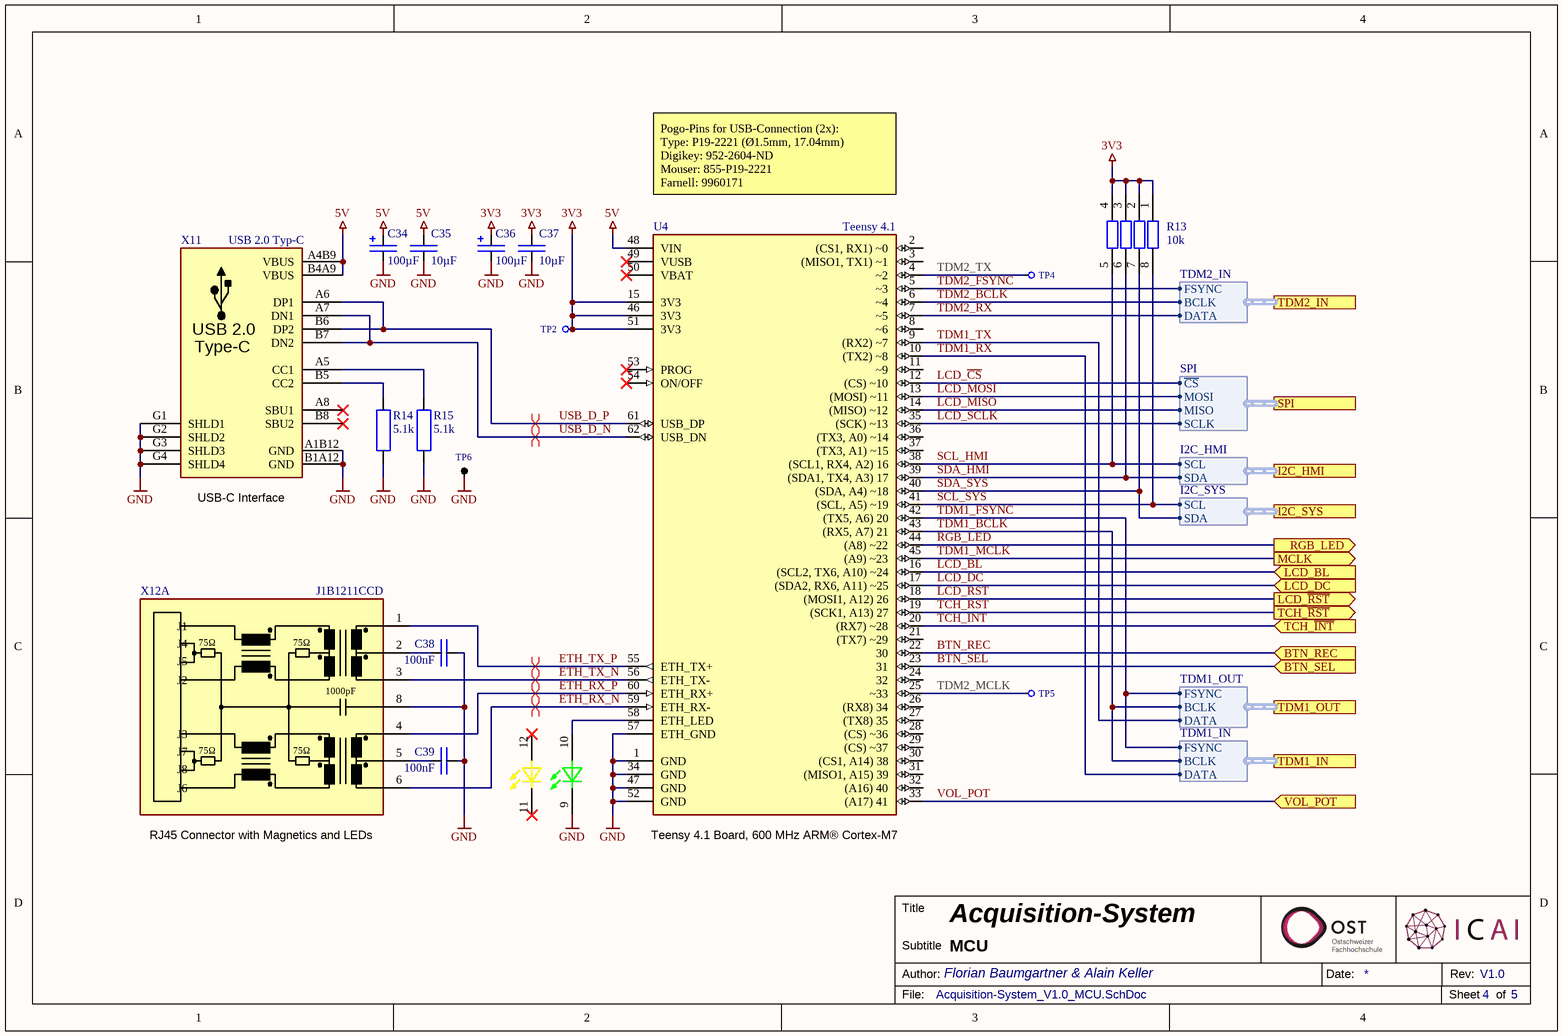
[diagram p4: Acquisition-System_V1.0_MCU.SchDoc]

### Parts
C34  100µF  [SMD Tantalkondensator 1210 +]
C35  10µF  [SMD Keramikkondensator 1206]
C36  100µF  [SMD Tantalkondensator 1210 +]
C37  10µF  [SMD Keramikkondensator 1206]
C38  100nF  [SMD Keramikkondensator 0603]
C39  100nF  [SMD Keramikkondensator 0603]
R13  10k  [SMD Widerstand Array 4-Fach 0603]
R14  5.1k  [SMD Widerstand 0603]
R15  5.1k  [SMD Widerstand 0603]
TP2  X-TP  [THT Testpunkt Ø1mm]  (value not drawn)  (no BOM)
TP4  X-TP  [THT Testpunkt Ø1mm]  (value not drawn)  (no BOM)
TP5  X-TP  [THT Testpunkt Ø1mm]  (value not drawn)  (no BOM)
TP6  Schwarz  [THT Messpunkt Ø2.54mm Schwarz]  (value not drawn)
U4  Teensy 4.1  [THT Teensy 4.1]
X11  USB 2.0 Typ-C  [SMD USB-C Socket (A40-00119)]
X12  J1B1211CCD  [THT RJ45 Socket (J1B1211CCD)]  (parts A,B of 2)

### Ports
BTN_REC (in), BTN_SEL (in), I2C_HMI (harness I2C_HMI), I2C_SYS (harness I2C_SYS), LCD_BL (in), LCD_DC (in), LCD_~{RST} (out), MCLK (out), RGB_LED (out), SPI (harness SPI), TCH_~{INT} (in), TCH_~{RST} (out), TDM1_IN (harness TDM1_IN), TDM1_OUT (harness TDM1_OUT), TDM2_IN (harness TDM2_IN), VOL_POT (in)

### Harnesses
I2C_HMI: SCL, SDA
TDM1_IN: BCLK, FSYNC, DATA
I2C_SYS: SCL, SDA
TDM2_IN: BCLK, FSYNC, DATA
TDM1_OUT: BCLK, FSYNC, DATA
SPI: SCLK, MOSI, ~{CS}, MISO

### Nets
3V3: C36.P(+) C37.2 R13.1 R13.2 R13.3 R13.4 TP2.1 U4.15(3V3) U4.46(3V3) U4.51(3V3)
5V: C34.P(+) C35.2 U4.48(VIN) X11.A4B9(VBUS) X11.B4A9(VBUS)
GND: C34.M(-) C35.1 C36.M(-) C37.1 C38.1 C39.1 R14.2 R15.2 TP6.1 U4.1(GND) U4.34(GND) U4.47(GND) U4.52(GND) U4.57(ETH_GND) X11.A1B12(GND) X11.B1A12(GND) X11.G1(SHLD1) X11.G2(SHLD2) X11.G3(SHLD3) X11.G4(SHLD4) X12.8(VC1-) X12.9(LEDYK)
BTN_REC: U4.22(30) ; port BTN_REC
BTN_SEL: U4.23(31) ; port BTN_SEL
ETH_RX_N: U4.59(ETH_RX-) X12.6(RD-)
ETH_RX_P: U4.60(ETH_RX+) X12.4(RD+)
ETH_TX_N: U4.56(ETH_TX-) X12.3(TD-)
ETH_TX_P: U4.55(ETH_TX+) X12.1(TD+)
LCD_BL: U4.16((SCL2,_TX6,_A10)_~24) ; port LCD_BL
LCD_~{CS}: U4.12((CS)_~10) ; port SPI.~{CS}
LCD_DC: U4.17((SDA2,_RX6,_A11)_~25) ; port LCD_DC
LCD_MISO: U4.14((MISO)_~12) ; port SPI.MISO
LCD_MOSI: U4.13((MOSI)_~11) ; port SPI.MOSI
LCD_~{RST}: U4.18((MOSI1,_A12)_26) ; port LCD_~{RST}
LCD_SCLK: U4.35((SCK)_~13) ; port SPI.SCLK
RGB_LED: U4.44((A8)_~22) ; port RGB_LED
SCL_HMI: R13.5 U4.38((SCL1,_RX4,_A2)_16) ; port I2C_HMI.SCL  [project net HMI_SCL]
SCL_SYS: R13.8 U4.41((SCL,_A5)_~19) ; port I2C_SYS.SCL
SDA_HMI: R13.6 U4.39((SDA1,_TX4,_A3)_17) ; port I2C_HMI.SDA  [project net HMI_SDA]
SDA_SYS: R13.7 U4.40((SDA,_A4)_~18) ; port I2C_SYS.SDA
TCH_~{INT}: U4.20((RX7)_~28) ; port TCH_~{INT}
TCH_~{RST}: U4.19((SCK1,_A13)_27) ; port TCH_~{RST}
TDM1_BCLK: U4.43((RX5,_A7)_21) ; port TDM1_IN.BCLK, port TDM1_OUT.BCLK
TDM1_FSYNC: U4.42((TX5,_A6)_20) ; port TDM1_IN.FSYNC, port TDM1_OUT.FSYNC
TDM1_MCLK: U4.45((A9)_~23) ; port MCLK
TDM1_RX: U4.10(NC) ; port TDM1_IN.DATA
TDM1_TX: U4.9(NC) ; port TDM1_OUT.DATA
TDM2_BCLK: U4.6(~4) ; port TDM2_IN.BCLK
TDM2_FSYNC: U4.5(~3) ; port TDM2_IN.FSYNC
TDM2_RX: U4.7(~5) ; port TDM2_IN.DATA
USB_D_N: U4.62(USB_DN) X11.A7(DN1) X11.B7(DN2)
USB_D_P: U4.61(USB_DP) X11.A6(DP1) X11.B6(DP2)
VOL_POT: U4.33((A17)_41) ; port VOL_POT
NetC38_2: C38.2 X12.2(TCT)
NetC39_2: C39.2 X12.5(RCT)
NetR14_1: R14.1 X11.B5(CC2)
NetR15_1: R15.1 X11.A5(CC1)
NetTP4_1: TP4.1 U4.4(~2)
NetTP5_1: TP5.1 U4.25(~33)
NetU4_58: U4.58(ETH_LED) X12.10(LEDYA)

Not connected (* = marked no-connect by the designer): U4 2((CS1,_RX1)_~0) 3((MISO1,_TX1)_~1) 8(~6) 11(NC) 21((TX7)_~29) 24(32) 26((RX8)_34) 27((TX8)_35) 28((CS)_~36) 29((CS)_~37) 30((CS1,_A14)_38) 31((MISO1,_A15)_39) 32((A16)_40) 36((TX3,_A0)_~14) 37((TX3,_A1)_~15) 49(VUSB)* 50(VBAT)* 53(PROG)* 54(ON/OFF)*; X11 A8(SBU1)* B8(SBU2)*; X12 7(NC) 11(LEDGK)* 12(LEDGA)*

### Layout directives
differential pair: ETH_RX_N, ETH_RX_P, ETH_TX_N, ETH_TX_P, USB_D_N, USB_D_P

### Notes on the sheet
- Pogo-Pins for USB-Connection (2x):
  Type: P19-2221 (Ø1.5mm, 17.04mm)
  Digikey: 952-2604-ND
  Mouser: 855-P19-2221
  Farnell: 9960171
- TDM2_TX
- (near X11) USB-C Interface
- TDM2_MCLK
- (near X12) RJ45 Connector with Magnetics and LEDs
- (near U4) Teensy 4.1 Board, 600 MHz ARM® Cortex-M7
- Title
- Author:
- Subtitle
- Date:
- Rev:
- File:
- Sheet
- of
- (in symbol X-J1B1211CCD, part A) J1; 75Ω; J4; J5; J2; 1000pF; J3; J7; J8; J6
- (in symbol X-USB-Buchse) USB 2.0; Type-C

### Library data of the parts
C34 C36 = C-ELCAP: CAP-Elko; Component Description: Tantalum Capacitor; Component Value: 100µF 6.3V; Digikey: 478-1677-1-ND; Farnell: 1135048; Mouser: 581-TAJB107K006R; JLC-Parts: C16133; Unit Price: 0.08
C35 C37 = E6 - 10uF: as C17 on sheet Acquisition-System_V1.0_Headphones; ComponentLink1Description: Datasheet; ComponentLink1URL: https://datasheet.lcsc.com/lcsc/1810191219_Samsung-Electro-Mechanics-CL10A106KP8NNNC_C19702.pdf; Digikey: 587-3258-1-ND; Farnell: 2113070; JLC-Parts: C13585; Mouser: 963-LMK107BBJ106MALT; Unit Price: 0.01
C38 C39 = E6 - 100nF: as C1 on sheet Acquisition-System_V1.0_Input; ComponentLink1Description: Datasheet; ComponentLink1URL: https://datasheet.lcsc.com/lcsc/1809301912_YAGEO-CC0603KRX7R9BB104_C14663.pdf; Digikey: 445-6899-1-ND; Farnell: 2210822; JLC-Parts: C14663; Mouser: 810-CGA2B3X7R1H104K; Unit Price: 0.01
R13 = R-Array Single Quad E24 - 10k: as R5 on sheet Acquisition-System_V1.0_Input; ComponentLink1Description: Datasheet; ComponentLink1URL: https://datasheet.lcsc.com/lcsc/1810191515_UNI-ROYAL-Uniroyal-Elec-4D03WGJ0103T5E_C29718.pdf; Digikey: Y4103CT-ND; Farnell: 2060167; JLC-Parts: C29718; Mouser: 667-EXB-V8V103JV; Unit Price: 0.01; Component Description: Isolated Resistor Array
R14 R15 = R-RESISTOR: RES (E=Heizwiderstand B=Messwandler); Component Description: Thick Film Chip Resistor; Component Value: 5.1k (75V, 100mW, 1%); Digikey: P5.10KHCT-ND; Farnell: 2059378; Mouser: 667-ERJ-3EKF5101V; JLC-Parts: C23186; Unit Price: 0.01
TP2 TP4 TP5 = X-TP: Testpunkt; Component Value: Ø 0.8mm; Component Description: Testpunkt; Unit Price: 0.00
TP6 = X-MP: Messpunkt; Component Description: Ground-Clip; Component Value: Ø 2.54mm (Black); Digikey: 36-5001-ND; Farnell: 2301278; Mouser: 534-5001; JLC-Parts: C238122; Unit Price: 0.36
U4 = U-Teensy-4.1: RT1062 i.MX ARM® Cortex®-M7 MPU; ComponentLink1Description: Datasheet; ComponentLink1URL: https://mm.digikey.com/Volume0/opasdata/d220001/medias/docus/497/DEV-16771_Web.pdf; Digikey: 1568-DEV-16771-ND; Component Value: Teensy 4.1; Mouser: 474-DEV-16771; Unit Price: 28.70; Component Description: RT1062 i.MX ARM® Cortex®-M7 MPU
X11 = X-USB-Buchse: Typ-C; aliExpress: 33045191307; Component Description: USB Connector Type-C; Component Value: USB4105-GF-A; Digikey: 2073-USB4105-GF-ACT-ND; Farnell: 3583366; ComponentLink1Description: Datasheet; ComponentLink1URL: https://datasheet.lcsc.com/lcsc/2103051833_Jing-Extension-of-the-Electronic-Co--918-418K2023S40001_C167321.pdf; JLC-Parts: C167321; Unit Price: 0.34
X12 = X-J1B1211CCD: RJ45 Connector with Magnetics and LEDs; DigiKey: 1278-1052-ND; Mouser: 950-J1B1211CCD; Component Description: RJ45 Connector with Magnetics and LEDs; Component Value: J1B1211CCD; JLC-Parts: C910371; Unit Price: 1.85; ComponentLink2Description: Datasheet; ComponentLink2URL: https://datasheet.lcsc.com/lcsc/2011180207_WIZNET-J1B1211CCD_C910371.pdf

## Nets that join several sheets
1V8: PDM-Microphone Input (C2A.2 U1A.14), PDM-Microphone Input (C2B.2 U1B.14), PDM-Microphone Input (C2C.2 U1C.14), PDM-Microphone Input (C2D.2 U1D.14), Acquisition-System_V1.0_Headphones (9 pins)
3V3: Acquisition-System_V1.0 (R2.2), PDM-Microphone Input (13 pins), PDM-Microphone Input (12 pins), PDM-Microphone Input (12 pins), PDM-Microphone Input (12 pins), Acquisition-System_V1.0_Headphones (C13.2 C14.2 U3.4 U3.19), Acquisition-System_V1.0_HMI (9 pins), Acquisition-System_V1.0_MCU (10 pins)
5V: PDM-Microphone Input (24 pins), PDM-Microphone Input (24 pins), PDM-Microphone Input (24 pins), PDM-Microphone Input (24 pins), Acquisition-System_V1.0_Headphones (C15.2 TP3.1 U2.3), Acquisition-System_V1.0_HMI (5 pins), Acquisition-System_V1.0_MCU (5 pins)
GND: Acquisition-System_V1.0 (R1.1), PDM-Microphone Input (41 pins), PDM-Microphone Input (41 pins), PDM-Microphone Input (41 pins), PDM-Microphone Input (42 pins), Acquisition-System_V1.0_Headphones (35 pins), Acquisition-System_V1.0_HMI (17 pins), Acquisition-System_V1.0_MCU (22 pins)
BTN_REC: Acquisition-System_V1.0_HMI (R17.1 S1.1), Acquisition-System_V1.0_MCU (U4.22)
BTN_SEL: Acquisition-System_V1.0_HMI (R18.1 S2.1), Acquisition-System_V1.0_MCU (U4.23)
HMI_SCL: Acquisition-System_V1.0_HMI (U5.6 X13.2), Acquisition-System_V1.0_MCU (R13.5 U4.38)
HMI_SDA: Acquisition-System_V1.0_HMI (U5.5 X13.3), Acquisition-System_V1.0_MCU (R13.6 U4.39)
LCD_BL: Acquisition-System_V1.0_HMI (R20.2 X13.14), Acquisition-System_V1.0_MCU (U4.16)
LCD_~{CS}: Acquisition-System_V1.0_HMI (X13.7), Acquisition-System_V1.0_MCU (U4.12)
LCD_DC: Acquisition-System_V1.0_HMI (X13.9), Acquisition-System_V1.0_MCU (U4.17)
LCD_MISO: Acquisition-System_V1.0_HMI (X13.11), Acquisition-System_V1.0_MCU (U4.14)
LCD_MOSI: Acquisition-System_V1.0_HMI (X13.10), Acquisition-System_V1.0_MCU (U4.13)
LCD_~{RST}: Acquisition-System_V1.0_HMI (X13.6), Acquisition-System_V1.0_MCU (U4.18)
LCD_SCLK: Acquisition-System_V1.0_HMI (X13.8), Acquisition-System_V1.0_MCU (U4.35)
NetP1A_4: PDM-Microphone Input (P1A.4), PDM-Microphone Input (P16B.2)
NetP1B_4: PDM-Microphone Input (P1B.4), PDM-Microphone Input (P16C.2)
NetP1C_4: PDM-Microphone Input (P1C.4), PDM-Microphone Input (P16D.2)
NetP1D_4: PDM-Microphone Input (P1D.4), Acquisition-System_V1.0_HMI (P19.2)
NetR1_2: Acquisition-System_V1.0 (R1.2), PDM-Microphone Input (U1C.12)
NetR2_1: Acquisition-System_V1.0 (R2.1), PDM-Microphone Input (U1B.12)
RGB_LED: Acquisition-System_V1.0_HMI (K1.S), Acquisition-System_V1.0_MCU (U4.44)
SCL_SYS: PDM-Microphone Input (U1A.7), PDM-Microphone Input (U1B.7), PDM-Microphone Input (U1C.7), PDM-Microphone Input (U1D.7), Acquisition-System_V1.0_Headphones (U3.2), Acquisition-System_V1.0_MCU (R13.8 U4.41)
SDA_SYS: PDM-Microphone Input (U1A.8), PDM-Microphone Input (U1B.8), PDM-Microphone Input (U1C.8), PDM-Microphone Input (U1D.8), Acquisition-System_V1.0_Headphones (U3.3), Acquisition-System_V1.0_MCU (R13.7 U4.40)
TCH_~{INT}: Acquisition-System_V1.0_HMI (X13.4), Acquisition-System_V1.0_MCU (U4.20)
TCH_~{RST}: Acquisition-System_V1.0_HMI (X13.5), Acquisition-System_V1.0_MCU (U4.19)
TDM1_BCLK: PDM-Microphone Input (U1C.10), PDM-Microphone Input (U1D.10), Acquisition-System_V1.0_Headphones (U3.29), Acquisition-System_V1.0_MCU (U4.43)
TDM1_FSYNC: PDM-Microphone Input (U1C.9), PDM-Microphone Input (U1D.9), Acquisition-System_V1.0_Headphones (U3.30), Acquisition-System_V1.0_MCU (U4.42)
TDM1_MCLK: Acquisition-System_V1.0_Headphones (R6.1), Acquisition-System_V1.0_MCU (U4.45)
TDM1_RX: PDM-Microphone Input (U1C.11), PDM-Microphone Input (U1D.11), Acquisition-System_V1.0_MCU (U4.10)
TDM1_TX: Acquisition-System_V1.0_Headphones (U3.32), Acquisition-System_V1.0_MCU (U4.9)
TDM2_BCLK: PDM-Microphone Input (U1A.10), PDM-Microphone Input (U1B.10), Acquisition-System_V1.0_MCU (U4.6)
TDM2_FSYNC: PDM-Microphone Input (U1A.9), PDM-Microphone Input (U1B.9), Acquisition-System_V1.0_MCU (U4.5)
TDM2_RX: PDM-Microphone Input (U1A.11), PDM-Microphone Input (U1B.11), Acquisition-System_V1.0_MCU (U4.7)
VOL_POT: Acquisition-System_V1.0_HMI (C40.2 R16.M), Acquisition-System_V1.0_MCU (U4.33)